# Altium project wheel-leg-robot-V1.0.PrjPcb
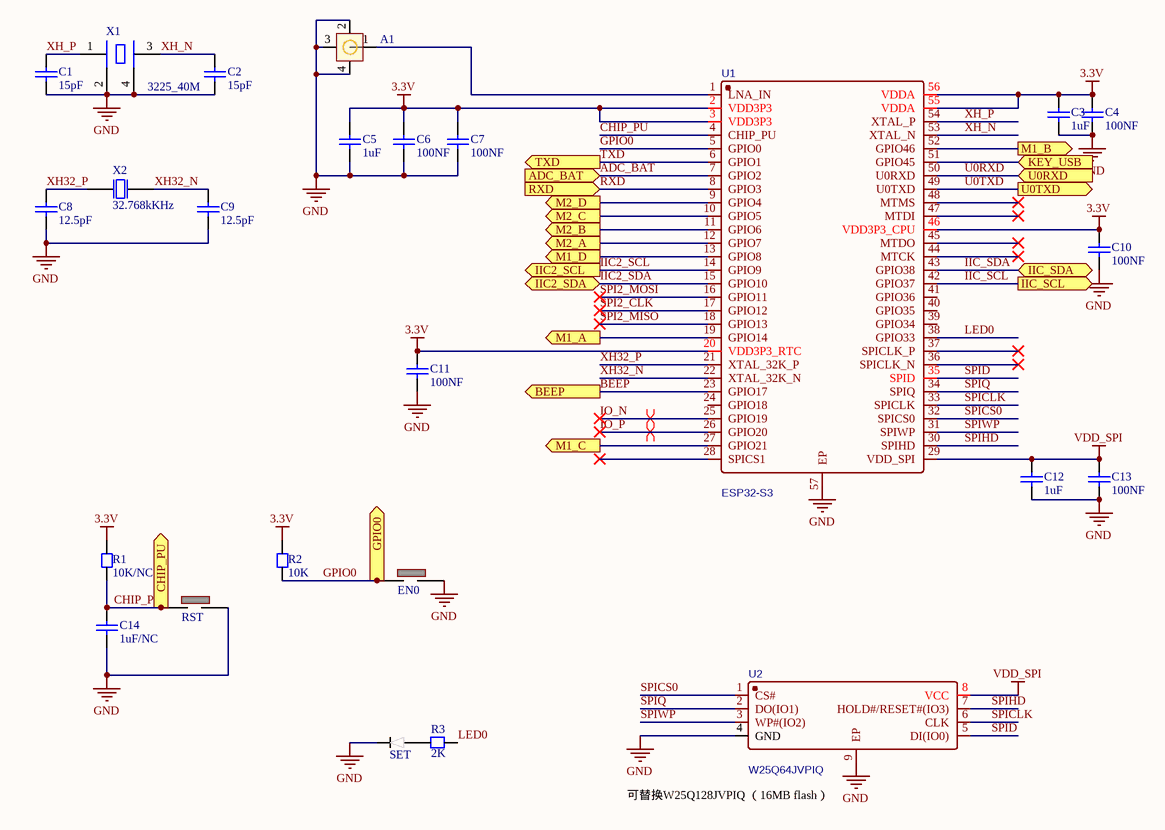
[diagram p0: Sheet1-MCU.SchDoc]
3 sheets, 114 parts. Net scope: flat (ports and power ports of the same name join across sheets).
Board file: PCB.PcbDoc
Sheets:
  Sheet1-MCU.SchDoc
  Sheet2-control.SchDoc
  Sheet3-USB.SchDoc

## Sheet Sheet1-MCU.SchDoc
size A4; SheetNumber: 1; SheetTotal: 3

### Parts
A1  ANT-IPEX  [IPEX-SMD_HC-RF-IPEX0303-01]  (value not drawn)
C1  15pF  [CC1608-0603]
C2  15pF  [CC1608-0603]
C3  1uF  [CC1608-0603]
C4  100NF  [CC1608-0603]
C5  1uF  [CC1608-0603]
C6  100NF  [CC1608-0603]
C7  100NF  [CC1608-0603]
C8  12.5pF  [CC1608-0603]
C9  12.5pF  [CC1608-0603]
C10  100NF  [CC1608-0603]
C11  100NF  [CC1608-0603]
C12  1uF  [CC1608-0603]
C13  100NF  [CC1608-0603]
C14  1uF/NC  [CC1608-0603]
EN0  KEY 3*4  [KEY 3*4]  (value not drawn)
R1  10K/NC  [CR1608-0603]
R2  10K  [CR1608-0603]
R3  2K  [CR1608-0603]
RST  KEY 3*4  [KEY 3*4]  (value not drawn)
SET  LED 0603  [LED 0603]  (value not drawn)
U1  ESP32-S3  [QFN-56]
U2  W25Q64JVPIQ  [WSON-8]
X1  3225_40M  [XTAL-3225]
X2  32.768kKHz  [XTAL-3215]

### Ports
ADC_BAT (in), BEEP (out), CHIP_PU (out), GPIO0 (out), IIC2_SCL (out), IIC2_SDA (bidir), IIC_SCL (out), IIC_SDA (bidir), KEY_USB (in), M1_A (out), M1_B (out), M1_C (out), M1_D (out), M2_A (out), M2_B (out), M2_C (out), M2_D (out), RXD (in), TXD (out), U0RXD (in), U0TXD (out)

### Nets
3.3V: C3.2 C4.2 C5.2 C6.2 C7.2 C10.2 C11.2 R1.2 R2.2 U1.2(VDD3P3) U1.3(VDD3P3) U1.20(VDD3P3_RTC) U1.46(VDD3P3_CPU) U1.55(VDDA) U1.56(VDDA)
GND: A1.2 A1.3 A1.4 C1.1 C2.1 C3.1 C4.1 C5.1 C6.1 C7.1 C8.1 C9.1 C10.1 C11.1 C12.1 C13.1 C14.1 EN0.2 RST.2 SET.2 U1.57(EP) U2.4(GND) U2.9(EP) X1.2(GND) X1.4(GND)
VDD_SPI: C12.2 C13.2 U1.29(VDD_SPI) U2.8(VCC)
ADC_BAT: U1.7(GPIO2) ; port ADC_BAT
BEEP: U1.23(GPIO17) ; port BEEP
CHIP_PU: C14.2 R1.1 RST.1 U1.4(CHIP_PU) ; port CHIP_PU
GPIO0: EN0.1 R2.1 U1.5(GPIO0) ; port GPIO0
IIC2_SCL: U1.14(GPIO9) ; port IIC2_SCL
IIC2_SDA: U1.15(GPIO10) ; port IIC2_SDA
IIC_SCL: U1.42(GPIO37) ; port IIC_SCL
IIC_SDA: U1.43(GPIO38) ; port IIC_SDA
IO_N: U1.25(GPIO19)
IO_P: U1.26(GPIO20)
KEY_USB: U1.51(GPIO45) ; port KEY_USB
LED0: R3.1 U1.38(GPIO33)
M1_A: U1.19(GPIO14) ; port M1_A
M1_B: U1.52(GPIO46) ; port M1_B
M1_C: U1.27(GPIO21) ; port M1_C
M1_D: U1.13(GPIO8) ; port M1_D
M2_A: U1.12(GPIO7) ; port M2_A
M2_B: U1.11(GPIO6) ; port M2_B
M2_C: U1.10(GPIO5) ; port M2_C
M2_D: U1.9(GPIO4) ; port M2_D
RXD: U1.8(GPIO3) ; port RXD
SPI2_CLK: U1.17(GPIO12)
SPI2_MISO: U1.18(GPIO13)
SPI2_MOSI: U1.16(GPIO11)
SPICLK: U1.33(SPICLK) U2.6(CLK)
SPICS0: U1.32(SPICS0) U2.1(CS#)
SPID: U1.35(SPID) U2.5(DI(IO0))
SPIHD: U1.30(SPIHD) U2.7(HOLD#/RESET#(IO3))
SPIQ: U1.34(SPIQ) U2.2(DO(IO1))
SPIWP: U1.31(SPIWP) U2.3(WP#(IO2))
TXD: U1.6(GPIO1) ; port TXD
U0RXD: U1.50(U0RXD) ; port U0RXD
U0TXD: U1.49(U0TXD) ; port U0TXD
XH32_N: C9.2 U1.22(XTAL_32K_N) X2.2(OSC2)
XH32_P: C8.2 U1.21(XTAL_32K_P) X2.1(OSC1)
XH_N: C2.2 U1.53(XTAL_N) X1.3(OSC2)
XH_P: C1.2 U1.54(XTAL_P) X1.1(OSC1)
NetA1_1: A1.1 U1.1(LNA_IN)
NetR3_2: R3.2 SET.1

Not connected (* = marked no-connect by the designer): U1 24(GPIO18) 28(SPICS1)* 36(SPICLK_N)* 37(SPICLK_P)* 39(GPIO34) 40(GPIO35) 41(GPIO36) 44(MTCK)* 45(MTDO)* 47(MTDI)* 48(MTMS)*

### Layout directives
differential pair: IO_N, IO_P

### Notes on the sheet
- (near U2) 可替换W25Q128JVPIQ （16MB flash）

### Library data of the parts
A1 = ANT-IPEX: 贴片封装的天线 封装类型为IPEX
C1-C14 = Cap Chip 0603: 0603封装的电容; Published: 8-Jun-2000; Revision: July-2002: Re-released for DXP Platform.; Publisher: Altium Limited
EN0 RST = KEY 3*4: 轻触开关按键
R1-R3 = Resistor Chip 0603: 0603封装电阻; Published: 8-Jun-2000; Revision: July-2002: Re-released for DXP Platform.; Publisher: Altium Limited
U1 = ESP32-S3: Manufacturer: ESPRESSIF(乐鑫); Contributor: LCSC; Supplier: LCSC; Supplier Part: C2913192; Manufacturer Part: ESP32-S3; JLCPCB Part Class: Extended Part; spicePre: U; spiceSymbolName: ESP32-S3
U2 = W25Q128JVPIQ: Manufacturer: WINBOND(华邦); Contributor: LCSC; Supplier: LCSC; Supplier Part: C2803379; Manufacturer Part: W25Q128JVPIQ; JLCPCB Part Class: Extended Part; spicePre: U; spiceSymbolName: W25Q128JVPIQ
X1 = XTAL 3225: 3225封装的晶振
X2 = XTAL 3215 32.768kKHz: 3215封装的时钟晶振

## Sheet Sheet2-control.SchDoc
size A4; SheetNumber: 2; SheetTotal: 3
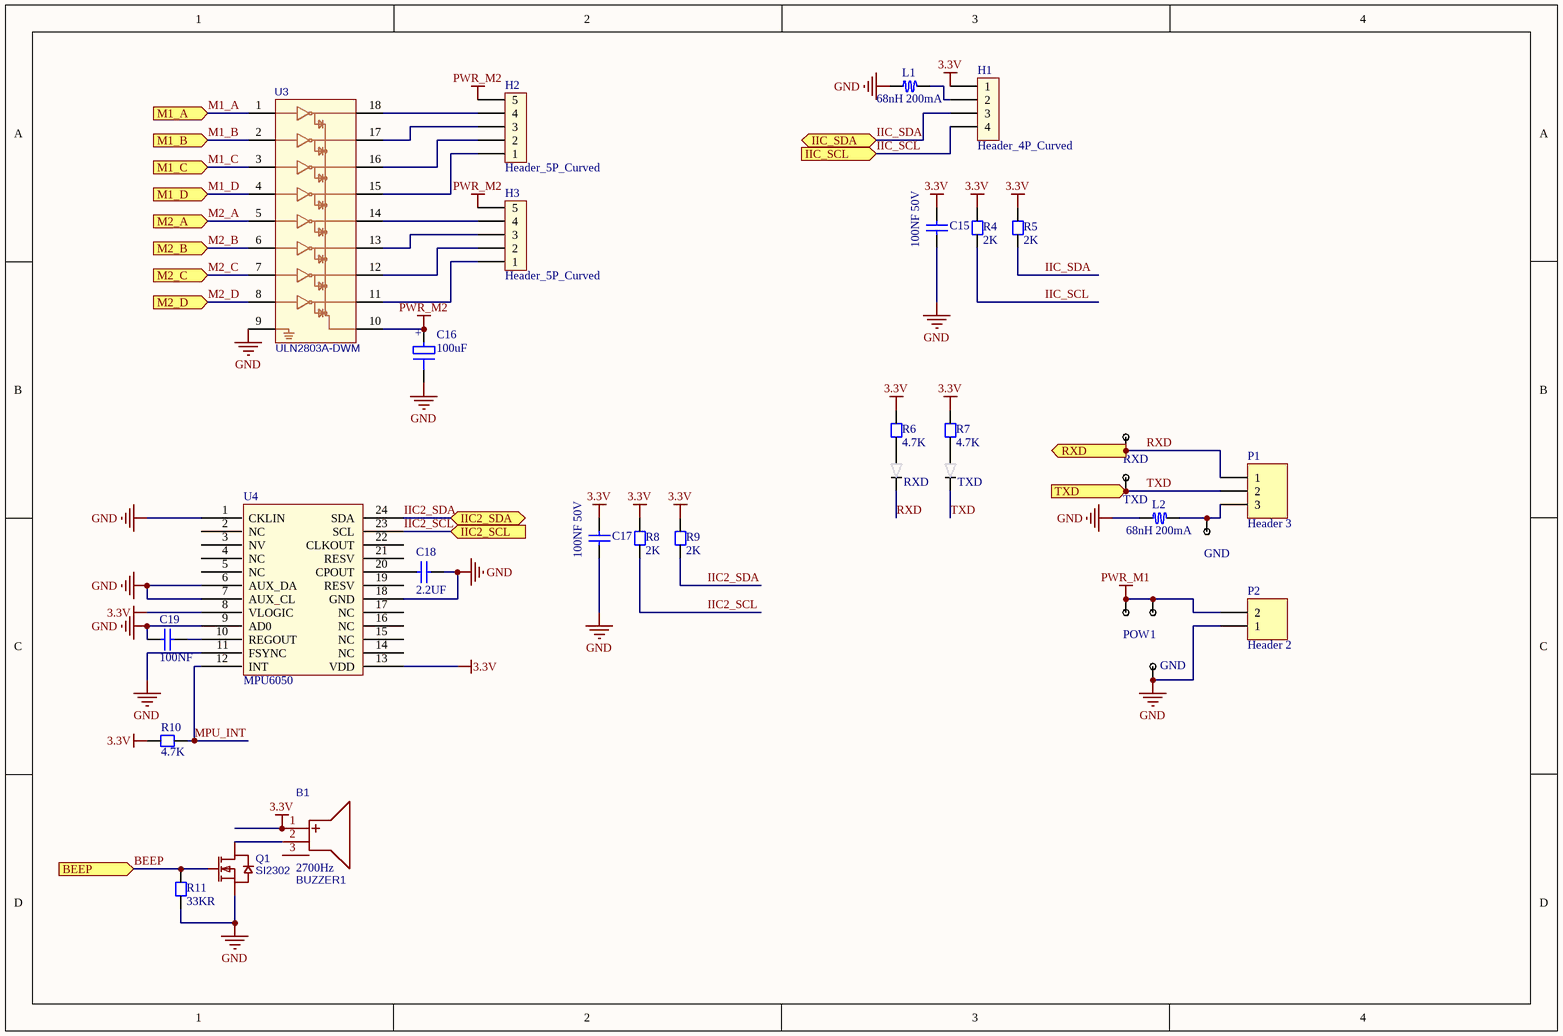
[diagram p1: Sheet2-control.SchDoc]

### Parts
(Parts that share a designator on the sheet are numbered #1, #2 ... from top to bottom, then left to right.)
1  pogopin  [pogopin]  (value not drawn)
B1  BUZZER1  [BUZ-SMD_GSC7525RA]
C15  100NF 50V  [CC1608-0603]
C16  100uF  [TAN-B_3528]
C17  100NF 50V  [CC1608-0603]
C18  2.2UF  [CC1608-0603]
C19  100NF  [CC1608-0603]
GND#1  pogopin  [pogopin]  (value not drawn)
GND#2  pogopin  [pogopin]  (value not drawn)
H1  Header_4P_Curved  [Header_2_54_4PW]
H2  Header_5P_Curved  [Header_2_54_5PW]
H3  Header_5P_Curved  [Header_2_54_5PW]
L1  68nH 200mA  [Inductor-0603]
L2  68nH 200mA  [Inductor-0603]
P1  Header 3  [HDR1X3]
P2  Header 2  [HDR1X2]
POW  pogopin  [pogopin]  (value not drawn)
Q1  SI2302  [SOT-23]
R4  2K  [CR1608-0603]
R5  2K  [CR1608-0603]
R6  4.7K  [CR1608-0603]
R7  4.7K  [CR1608-0603]
R8  2K  [CR1608-0603]
R9  2K  [CR1608-0603]
R10  4.7K  [CR1608-0603]
R11  33KR  [CR1608-0603]
RXD#1  pogopin  [pogopin]  (value not drawn)
RXD#2  LED 0603  [LED 0603]  (value not drawn)
TXD#1  LED 0603  [LED 0603]  (value not drawn)
TXD#2  pogopin  [pogopin]  (value not drawn)
U3  ULN2803A-DWM  [SOP-18]
U4  MPU6050  [QFN24 - duplicate]

### Ports
BEEP (in), IIC2_SCL (in), IIC2_SDA (bidir), IIC_SCL (in), IIC_SDA (bidir), M1_A (in), M1_B (in), M1_C (in), M1_D (in), M2_A (in), M2_B (in), M2_C (in), M2_D (in), RXD (out), TXD (in)

### Nets
3.3V: B1.1(+) C15.2 C17.2 H1.1 R4.1 R5.1 R6.1 R7.1 R8.1 R9.1 R10.1 U4.8(VLOGIC) U4.13(VDD)
GND: C15.1 C16.2(-) C17.1 C18.2 C19.1 GND#2.1 L1.1 L2.1 P2.1 Q1.2(S) R11.2 U3.9(GND) U4.1(CKLIN) U4.6(AUX_DA) U4.7(AUX_CL) U4.9(AD0) U4.11(FSYNC) U4.18(GND)
PWR_M1: 1.1 P2.2 POW.1
PWR_M2: C16.1(+) H2.5 H3.5 U3.10(COMMON)
BEEP: Q1.1(G) R11.1 ; port BEEP
IIC2_SCL: R8.2 U4.23(SCL) ; port IIC2_SCL
IIC2_SDA: R9.2 U4.24(SDA) ; port IIC2_SDA
IIC_SCL: H1.4 R4.2 ; port IIC_SCL
IIC_SDA: H1.3 R5.2 ; port IIC_SDA
M1_A: U3.1(I1) ; port M1_A
M1_B: U3.2(I2) ; port M1_B
M1_C: U3.3(I3) ; port M1_C
M1_D: U3.4(I4) ; port M1_D
M2_A: U3.5(I5) ; port M2_A
M2_B: U3.6(I6) ; port M2_B
M2_C: U3.7(I7) ; port M2_C
M2_D: U3.8(I8) ; port M2_D
MPU_INT: R10.2 U4.12(INT)
RXD: P1.1 RXD#1.1 RXD#2.2 ; port RXD
TXD: P1.2 TXD#1.2 TXD#2.1 ; port TXD
NetB1_2: B1.2(-) Q1.3(D)
NetC18_1: C18.1 U4.20(CPOUT)
NetC19_2: C19.2 U4.10(REGOUT)
NetGND#1_1: GND#1.1 L2.2 P1.3
NetH1_2: H1.2 L1.2
NetH2_1: H2.1 U3.15(O4)
NetH2_2: H2.2 U3.16(O3)
NetH2_3: H2.3 U3.17(O2)
NetH2_4: H2.4 U3.18(O1)
NetH3_1: H3.1 U3.11(O8)
NetH3_2: H3.2 U3.12(O7)
NetH3_3: H3.3 U3.13(O6)
NetH3_4: H3.4 U3.14(O5)
NetR6_2: R6.2 RXD#2.1
NetR7_2: R7.2 TXD#1.1

Not connected (* = marked no-connect by the designer): B1 3(EH); U4 2(NC) 3(NV) 4(NC) 5(NC) 14(NC) 15(NC) 16(NC) 17(NC) 19(RESV) 21(RESV) 22(CLKOUT)

### Library data of the parts
1 GND#1 GND#2 POW RXD#1 TXD#2 = pogopin: 插板式顶针 连接器弹簧天线插针SMT触点测试铜针双弹贴片式
B1 = BUZZER1: 2700Hz; Manufacturer: INGHAi(赢海); Manufacturer Part: GSC7525RA-16R2700; Contributor: LCSC; nameAlias: Value; Supplier: LCSC; Supplier Part: C255313; spicePre: B; spiceSymbolName: GSC7525RA-16R2700
C15 C17-C19 = Cap Chip 0603: 0603封装的电容; Published: 8-Jun-2000; Revision: July-2002: Re-released for DXP Platform.; Publisher: Altium Limited
C16 = CAP TAN-B-3528: 钽电容
H1 = Header_4P_Curved: 弯的4P排针
H2 H3 = Header_5P_Curved: 弯的6P排针
L1 L2 = Inductor-0603: 贴片电感 0603封装
P1 = Header 3: Header, 3-Pin; LatestRevisionDate: 17-Jul-2002; LatestRevisionNote: Re-released for DXP Platform.; Publisher: Altium Limited
P2 = Header 2: Header, 2-Pin; LatestRevisionDate: 17-Jul-2002; LatestRevisionNote: Re-released for DXP Platform.; Publisher: Altium Limited
Q1 = SI2302: N沟道 / 漏源电压(Vdss) 20V / 连续漏极电流(Id) 2.8A / 功率(Pd) 900mW / 导通电阻(RDS(on)@Vgs,Id) 55mΩ@4.5V,2.8A / 阈值电压(Vgs(th)@Id) 1.2V@250uA / 输入电容(Ciss@Vds) 260pF@10V; Manufacturer: TWGMC(台湾迪嘉); Manufacturer Part: SI2306; Contributor: LCSC; Supplier: LCSC; Supplier Part: C727154; JLCPCB Part Class: Extended Part; spicePre: Q; spiceSymbolName: SI2306_C727154
R4-R10 = Resistor Chip 0603: 0603封装电阻; Published: 8-Jun-2000; Revision: July-2002: Re-released for DXP Platform.; Publisher: Altium Limited
R11 = Chip resistor: 贴片电阻
U3 = ULN2803A: UMW ULN2803A SOP-18 达林顿阵列功率驱动集成电路芯片; Manufacturer: HGC(华冠); Manufacturer Part: ULN2803ADWM/TR; Contributor: lcsc; Supplier: LCSC; Supplier Part: C2683132; JLCPCB Part Class: Extended Part; spicePre: U; spiceSymbolName: ULN2803ADWM/TR
U4 = MPU6050: 陀螺仪

## Sheet Sheet3-USB.SchDoc
size A3; SheetNumber: 3; SheetTotal: 3
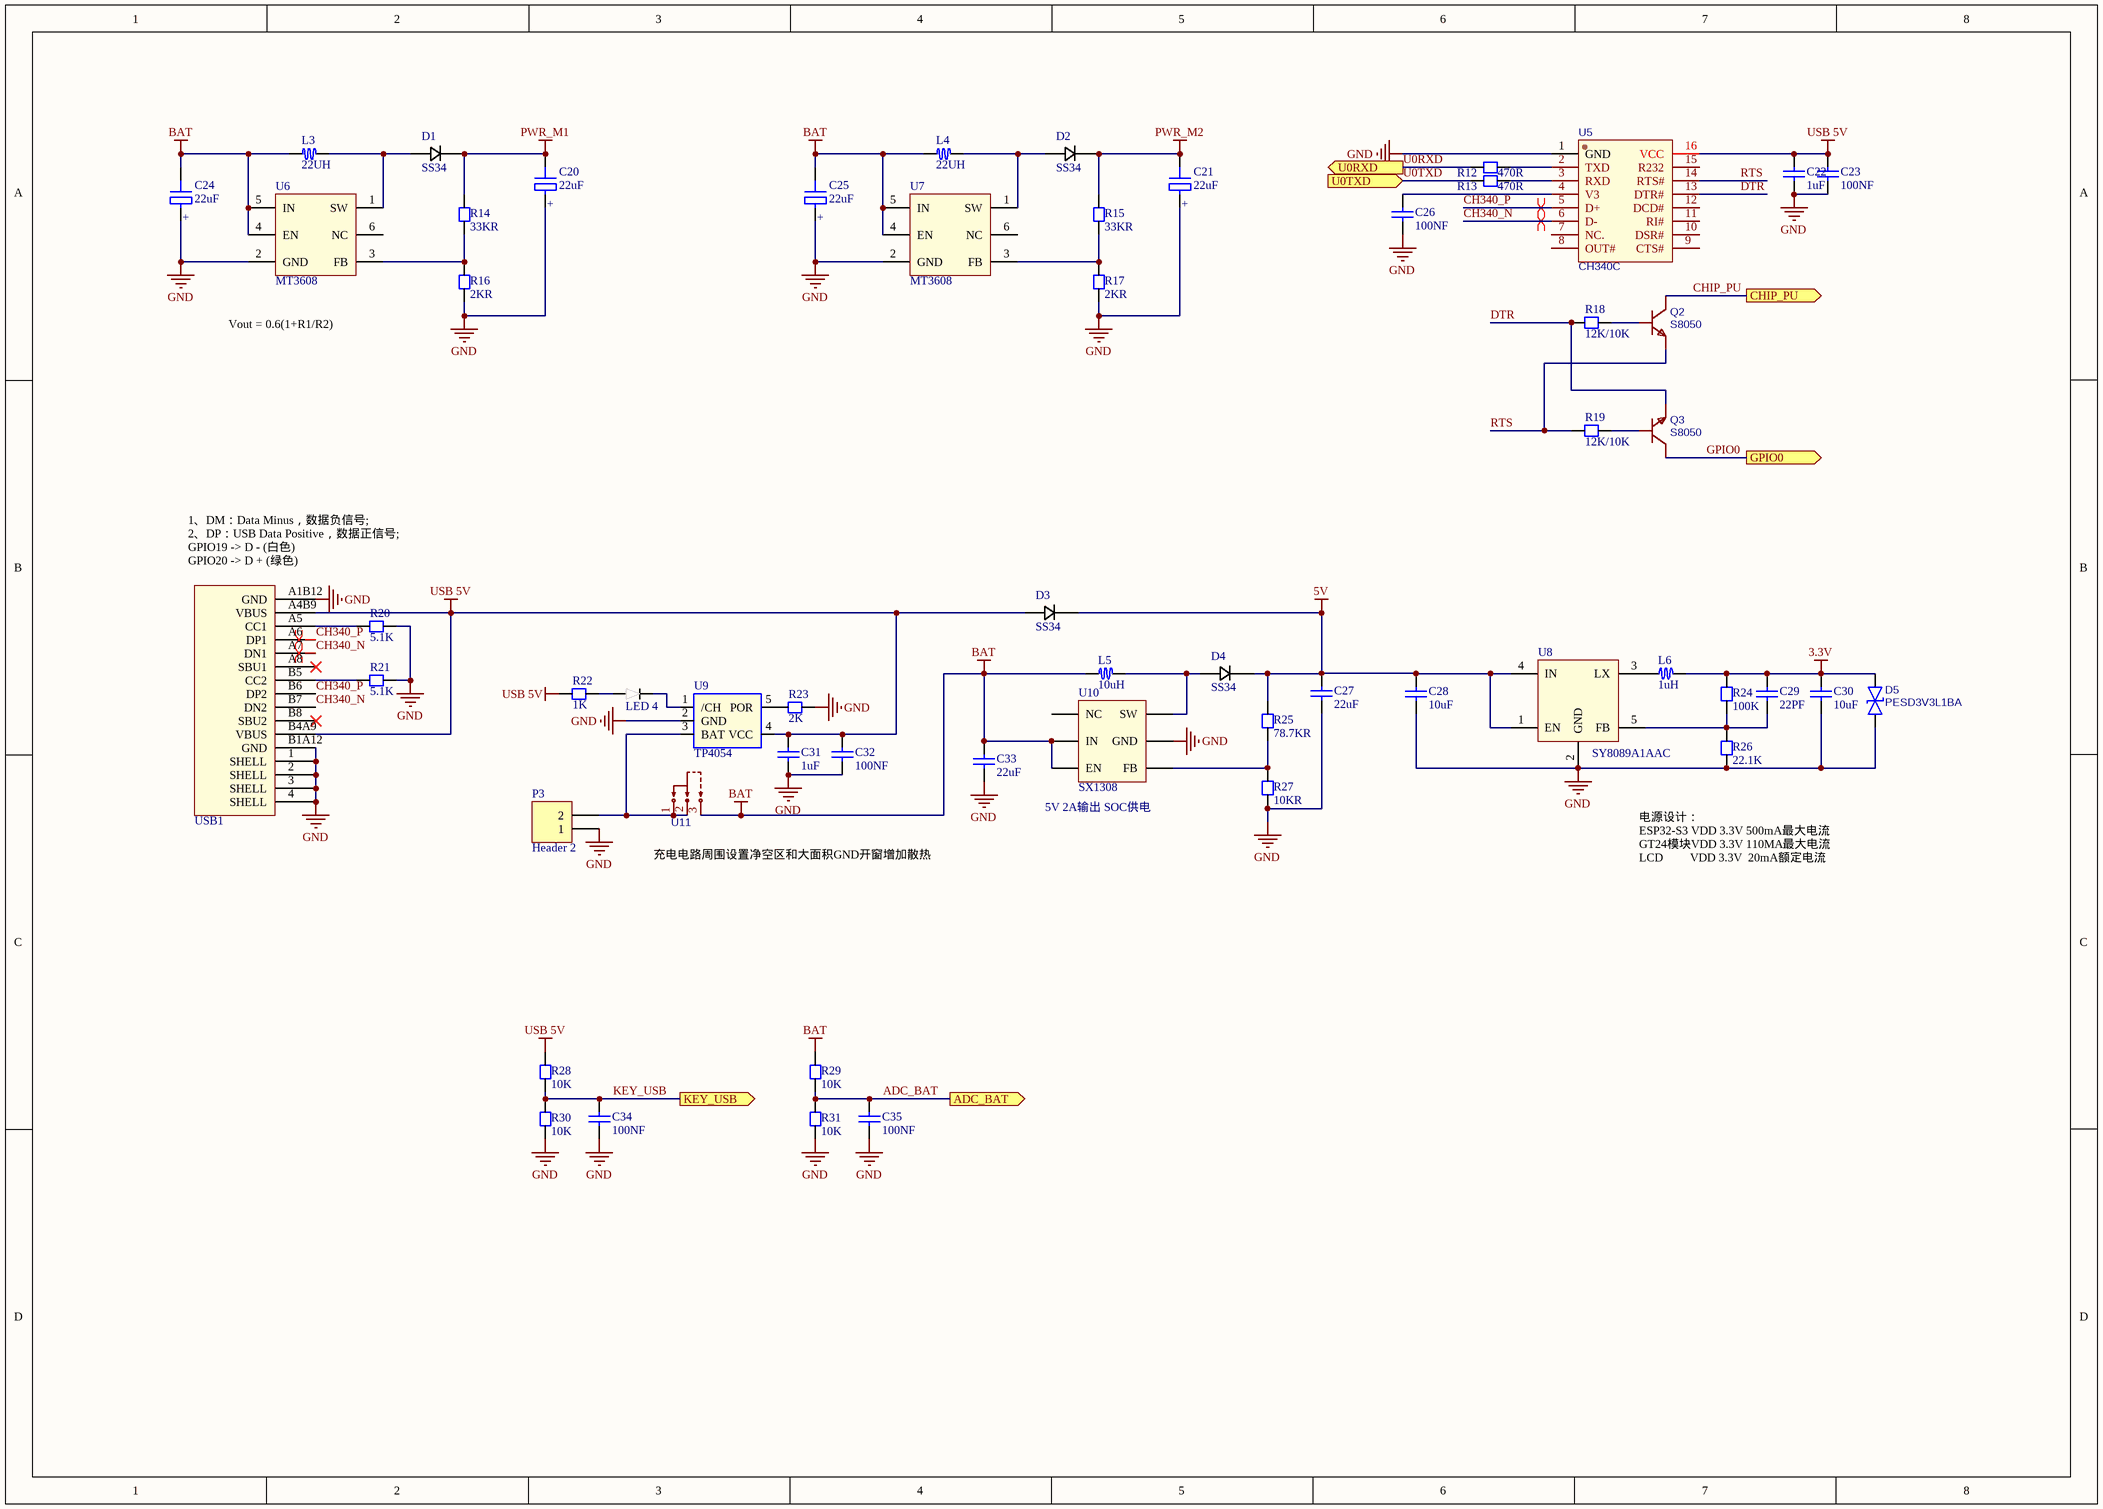
[diagram p2: Sheet3-USB.SchDoc]

### Parts
C20  22uF  [TAN-A-1206]
C21  22uF  [TAN-A-1206]
C22  1uF  [CC1608-0603]
C23  100NF  [CC1608-0603]
C24  22uF  [TAN-A-1206]
C25  22uF  [TAN-A-1206]
C26  100NF  [CC1608-0603]
C27  22uF  [CC1608-0603]
C28  10uF  [CC1608-0603]
C29  22PF  [CC1608-0603]
C30  10uF  [CC1608-0603]
C31  1uF  [CC1608-0603]
C32  100NF  [CC1608-0603]
C33  22uF  [CC1608-0603]
C34  100NF  [CC1608-0603]
C35  100NF  [CC1608-0603]
D1  SS34  [DO-214 AA]
D2  SS34  [DO-214 AA]
D3  SS34  [DO-214 AA]
D4  SS34  [DO-214 AA]
D5  PESD3V3L1BA  [SOD-323]
L3  22UH  [CDRH104R]
L4  22UH  [CDRH104R]
L5  10uH  [Inductor-6045]
L6  1uH  [Inductor-4018]
LED_4  LED 0603  [LED 0603]  (value not drawn)
P3  Header 2  [HX2.54-2]
Q2  S8050  [SOT-23]
Q3  S8050  [SOT-23]
R12  470R  [CR1608-0603]
R13  470R  [CR1608-0603]
R14  33KR  [CR1608-0603]
R15  33KR  [CR1608-0603]
R16  2KR  [CR1608-0603]
R17  2KR  [CR1608-0603]
R18  12K/10K  [CR1608-0603]
R19  12K/10K  [CR1608-0603]
R20  5.1K  [CR1608-0603]
R21  5.1K  [CR1608-0603]
R22  1K  [CR1608-0603]
R23  2K  [CR1608-0603]
R24  100K  [CR1608-0603]
R25  78.7KR  [CR1608-0603]
R26  22.1K  [CR1608-0603]
R27  10KR  [CR1608-0603]
R28  10K  [CR1608-0603]
R29  10K  [CR1608-0603]
R30  10K  [CR1608-0603]
R31  10K  [CR1608-0603]
U5  CH340C  [SOP-16]
U6  MT3608  [SOT23-6]
U7  MT3608  [SOT23-6]
U8  SY8089A1AAC  [SOT23-5]
U9  TP4054  [SOT23-5]
U10  SX1308  [SOT23-6]
U11  HX SS12D10G4  [SW-TH_3P-SS12D06]  (value not drawn)
USB1  Tpye-c 16P  [TYPE-C 16P]  (value not drawn)

### Ports
ADC_BAT (out), CHIP_PU (out), GPIO0 (out), KEY_USB (out), U0RXD (out), U0TXD (in)

### Nets
3.3V: C29.2 C30.2 D5.1 L6.2 R24.1
5V: C27.1 C28.2 D3.1(K) D4.1(K) R25.2 U8.1(EN) U8.4(IN)
BAT: C24.2(-) C25.2(-) C33.2 L3.1 L4.1 L5.1 R29.2 U6.4(EN) U6.5(IN) U7.4(EN) U7.5(IN) U10.4(EN) U10.5(IN) U11.3
GND: C20.1(+) C21.1(+) C22.1 C23.1 C24.1(+) C25.1(+) C26.1 C27.2 C28.1 C30.1 C31.1 C32.1 C33.1 C34.1 C35.1 D5.2 P3.1 R16.2 R17.2 R20.1 R21.1 R23.2 R26.2 R27.1 R30.1 R31.1 U5.1(GND) U6.2(GND) U7.2(GND) U8.2(GND) U9.2(GND) U10.2(GND) USB1.1(SHELL) USB1.2(SHELL) USB1.3(SHELL) USB1.4(SHELL) USB1.A1B12(GND) USB1.B1A12(GND)
PWR_M1: C20.2(-) D1.1(K) R14.1
PWR_M2: C21.2(-) D2.1(K) R15.1
USB 5V: C22.2 C23.2 C31.2 C32.2 D3.2(A) R22.1 R28.2 U5.16(VCC) U9.4(VCC) USB1.A4B9(VBUS) USB1.B4A9(VBUS)
ADC_BAT: C35.2 R29.1 R31.2 ; port ADC_BAT
CH340_N: U5.6(D-) USB1.A7(DN1) USB1.B7(DN2)
CH340_P: U5.5(D+) USB1.A6(DP1) USB1.B6(DP2)
CHIP_PU: Q2.3(C) ; port CHIP_PU
DTR: Q3.2(E) R18.1 U5.13(DTR#)
GPIO0: Q3.3(C) ; port GPIO0
KEY_USB: C34.2 R28.1 R30.2 ; port KEY_USB
RTS: Q2.2(E) R19.1 U5.14(RTS#)
U0RXD: R12.2 ; port U0RXD
U0TXD: R13.2 ; port U0TXD
NetC26_2: C26.2 U5.4(V3)
NetC29_1: C29.1 R24.2 R26.1 U8.5(FB)
NetD1_2: D1.2(A) L3.2 U6.1(SW)
NetD2_2: D2.2(A) L4.2 U7.1(SW)
NetD4_2: D4.2(A) L5.2 U10.1(SW)
NetL6_1: L6.1 U8.3(LX)
NetLED_4_1: LED_4.1 R22.2
NetLED_4_2: LED_4.2 U9.1(/CH)
NetP3_2: P3.2 U9.3(BAT) U11.1 U11.2
NetQ2_1: Q2.1(B) R18.2
NetQ3_1: Q3.1(B) R19.2
NetR12_1: R12.1 U5.2(TXD)
NetR13_1: R13.1 U5.3(RXD)
NetR14_2: R14.2 R16.1 U6.3(FB)
NetR15_2: R15.2 R17.1 U7.3(FB)
NetR20_2: R20.2 USB1.A5(CC1)
NetR21_2: R21.2 USB1.B5(CC2)
NetR23_1: R23.1 U9.5(POR)
NetR25_1: R25.1 R27.2 U10.3(FB)

Not connected (* = marked no-connect by the designer): U5 7(NC.) 8(OUT#) 9(CTS#) 10(DSR#) 11(RI#) 12(DCD#) 15(R232); U6 6(NC); U7 6(NC); U10 6(NC); USB1 A8(SBU1)* B8(SBU2)*

### Layout directives
differential pair: CH340_N, CH340_P

### Notes on the sheet
- Vout = 0.6(1+R1/R2)
- (near USB1) 1、DM：Data Minus，数据负信号;
  2、DP：USB Data Positive，数据正信号;
  GPIO19 -> D - (白色)
  GPIO20 -> D + (绿色)
- (near U11) 充电电路周围设置净空区和大面积GND开窗增加散热
- (near U10) 5V 2A输出 SOC供电
- 电源设计：
  ESP32-S3 VDD 3.3V 500mA最大电流
  GT24模块VDD 3.3V 110MA最大电流
  LCD         VDD 3.3V  20mA额定电流

### Library data of the parts
C20 C21 C24 C25 = CAP TAN-A-1206: 钽电容
C22 C23 C26 C28-C35 = Cap Chip 0603: 0603封装的电容; Published: 8-Jun-2000; Revision: July-2002: Re-released for DXP Platform.; Publisher: Altium Limited
C27 = Chip capacitor: 贴片电容
D1-D4 = SS34: 肖特基二极管
D5 = PESD3V3L1BA: SOD-323 3.3V 双向ESD防静电二极管保护芯片; Manufacturer: MDD; Manufacturer Part: SMAJ6.5CA; Supplier: LCSC; Supplier Part: C110041; JLCPCB Part Class: Extended Part; spicePre: D; spiceSymbolName: SMAJ6.5CA-C110041
L3 L4 = Inductor-CDRH104R: 贴片电感 CDRH104R 封装
L5 = Inductor-6045: 6045封装 线绕SMD功率电感
L6 = Inductor-4018: 贴片电感 1206封装
P3 = Header 2: Header, 2-Pin; LatestRevisionDate: 17-Jul-2002; LatestRevisionNote: Re-released for DXP Platform.; Publisher: Altium Limited
Q2 Q3 = S8050: Manufacturer: SALLTECH(萨瑞); Contributor: lcsc; Supplier: LCSC; Supplier Part: C3027096; Manufacturer Part: S8050; spicePre: Q; spiceSymbolName: S8050_C3027096
R12 R13 R18-R24 R26 R28-R31 = Resistor Chip 0603: 0603封装电阻; Published: 8-Jun-2000; Revision: July-2002: Re-released for DXP Platform.; Publisher: Altium Limited
R14-R17 R25 R27 = Chip resistor: 贴片电阻
U5 = CH340C: Manufacturer: WCH(南京沁恒); Supplier: LCSC; Manufacturer Part: CH340C; Supplier Part: C84681; JLCPCB Part Class: Extended Part; spicePre: U; spiceSymbolName: CH340C
U6 U7 = MT3608: • 2V to 24V Input Voltage / • 1.2MHz Fixed Switching Frequency / • Internal 4A Switch Current Limit / • Adjustable Output Voltage / • Internal Compensation / • Up to 28V Output VoltagE
U8 = SY8089A1AAC: SY8089A1是一种高效率的1.5MHz同步降压DC/DC稳压器，能够提供高达输出电流2A。它可以在2.5V到5.5V的宽输入电压范围内工作，集成了主开关和同步开关，具有极低的RDS(ON)，最大限度地减少了导通损耗。 / 输出电压纹波小，外接电感小，电容器尺寸小 / 1.5MHz开关频率。
U9 = TP4054: 迷你充电IC SOT-23-5
U10 = SX1308: SOT23-6 升压芯片
U11 = SW-TH_3P-SS12D06: BOM_Manufacturer: hanxia(韩下); Contributor: lcsc; BOM_Supplier: LCSC; BOM_Supplier Part: C5149841; BOM_Manufacturer Part: HX SS12D10G4; link: https://atta.szlcsc.com/upload/public/pdf/source/20220907/2020D7183ED16DD6E2B9F5A13FB144CF.pdf; BOM_JLCPCB Part Class: Extended Part; spicePre: U; spiceSymbolName: HX SS12D10G4
USB1 = Tpye-c 16P: 16P 封装的TYPE -c接口 4固定插脚 双向

## Nets that join several sheets
3.3V: Sheet1-MCU (15 pins), Sheet2-control (13 pins), Sheet3-USB (5 pins)
GND: Sheet1-MCU (25 pins), Sheet2-control (18 pins), Sheet3-USB (38 pins)
PWR_M1: Sheet2-control (1.1 P2.2 POW.1), Sheet3-USB (C20.2 D1.1 R14.1)
PWR_M2: Sheet2-control (C16.1 H2.5 H3.5 U3.10), Sheet3-USB (C21.2 D2.1 R15.1)
ADC_BAT: Sheet1-MCU (U1.7), Sheet3-USB (C35.2 R29.1 R31.2)
BEEP: Sheet1-MCU (U1.23), Sheet2-control (Q1.1 R11.1)
CHIP_PU: Sheet1-MCU (C14.2 R1.1 RST.1 U1.4), Sheet3-USB (Q2.3)
GPIO0: Sheet1-MCU (EN0.1 R2.1 U1.5), Sheet3-USB (Q3.3)
IIC2_SCL: Sheet1-MCU (U1.14), Sheet2-control (R8.2 U4.23)
IIC2_SDA: Sheet1-MCU (U1.15), Sheet2-control (R9.2 U4.24)
IIC_SCL: Sheet1-MCU (U1.42), Sheet2-control (H1.4 R4.2)
IIC_SDA: Sheet1-MCU (U1.43), Sheet2-control (H1.3 R5.2)
KEY_USB: Sheet1-MCU (U1.51), Sheet3-USB (C34.2 R28.1 R30.2)
M1_A: Sheet1-MCU (U1.19), Sheet2-control (U3.1)
M1_B: Sheet1-MCU (U1.52), Sheet2-control (U3.2)
M1_C: Sheet1-MCU (U1.27), Sheet2-control (U3.3)
M1_D: Sheet1-MCU (U1.13), Sheet2-control (U3.4)
M2_A: Sheet1-MCU (U1.12), Sheet2-control (U3.5)
M2_B: Sheet1-MCU (U1.11), Sheet2-control (U3.6)
M2_C: Sheet1-MCU (U1.10), Sheet2-control (U3.7)
M2_D: Sheet1-MCU (U1.9), Sheet2-control (U3.8)
RXD: Sheet1-MCU (U1.8), Sheet2-control (P1.1 RXD#1.1 RXD#2.2)
TXD: Sheet1-MCU (U1.6), Sheet2-control (P1.2 TXD#1.2 TXD#2.1)
U0RXD: Sheet1-MCU (U1.50), Sheet3-USB (R12.2)
U0TXD: Sheet1-MCU (U1.49), Sheet3-USB (R13.2)